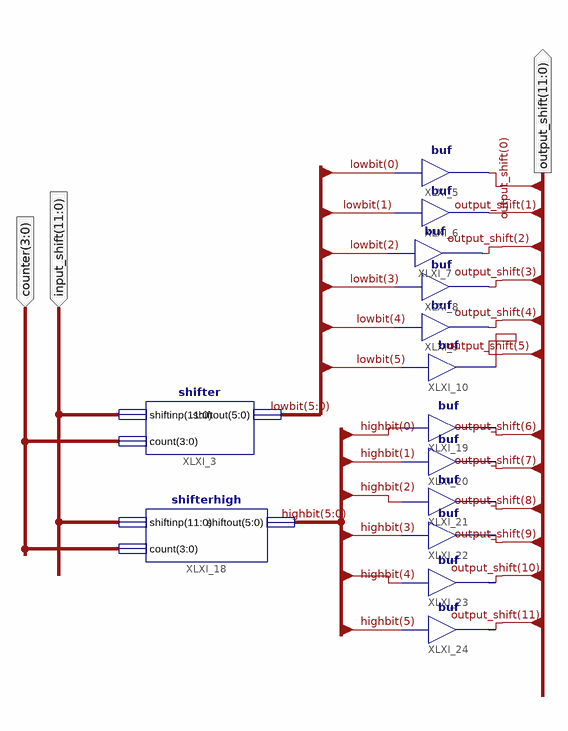
[diagram p0: schematic sheet 1]
// Xilinx ISE schematic shifter_full.sch (spartan3) as structural Verilog: 14 symbols, 3 ports
module shifter_full (
  input  [11:0] input_shift,
  input  [3:0] counter,
  output [11:0] output_shift
);

  wire [5:0] highbit, lowbit;

  shifter XLXI_3 (.shiftinp(input_shift), .count(counter), .shiftout(lowbit));
  buf XLXI_5 (output_shift[0], lowbit[0]);
  buf XLXI_6 (output_shift[1], lowbit[1]);
  buf XLXI_7 (output_shift[2], lowbit[2]);
  buf XLXI_8 (output_shift[3], lowbit[3]);
  buf XLXI_9 (output_shift[4], lowbit[4]);
  buf XLXI_10 (output_shift[5], lowbit[5]);
  shifterhigh XLXI_18 (.shiftinp(input_shift), .count(counter), .shiftout(highbit));
  buf XLXI_19 (output_shift[6], highbit[0]);
  buf XLXI_20 (output_shift[7], highbit[1]);
  buf XLXI_21 (output_shift[8], highbit[2]);
  buf XLXI_22 (output_shift[9], highbit[3]);
  buf XLXI_23 (output_shift[10], highbit[4]);
  buf XLXI_24 (output_shift[11], highbit[5]);
endmodule
